# EAGLE schematic PR5009 (EAGLE 6.4)
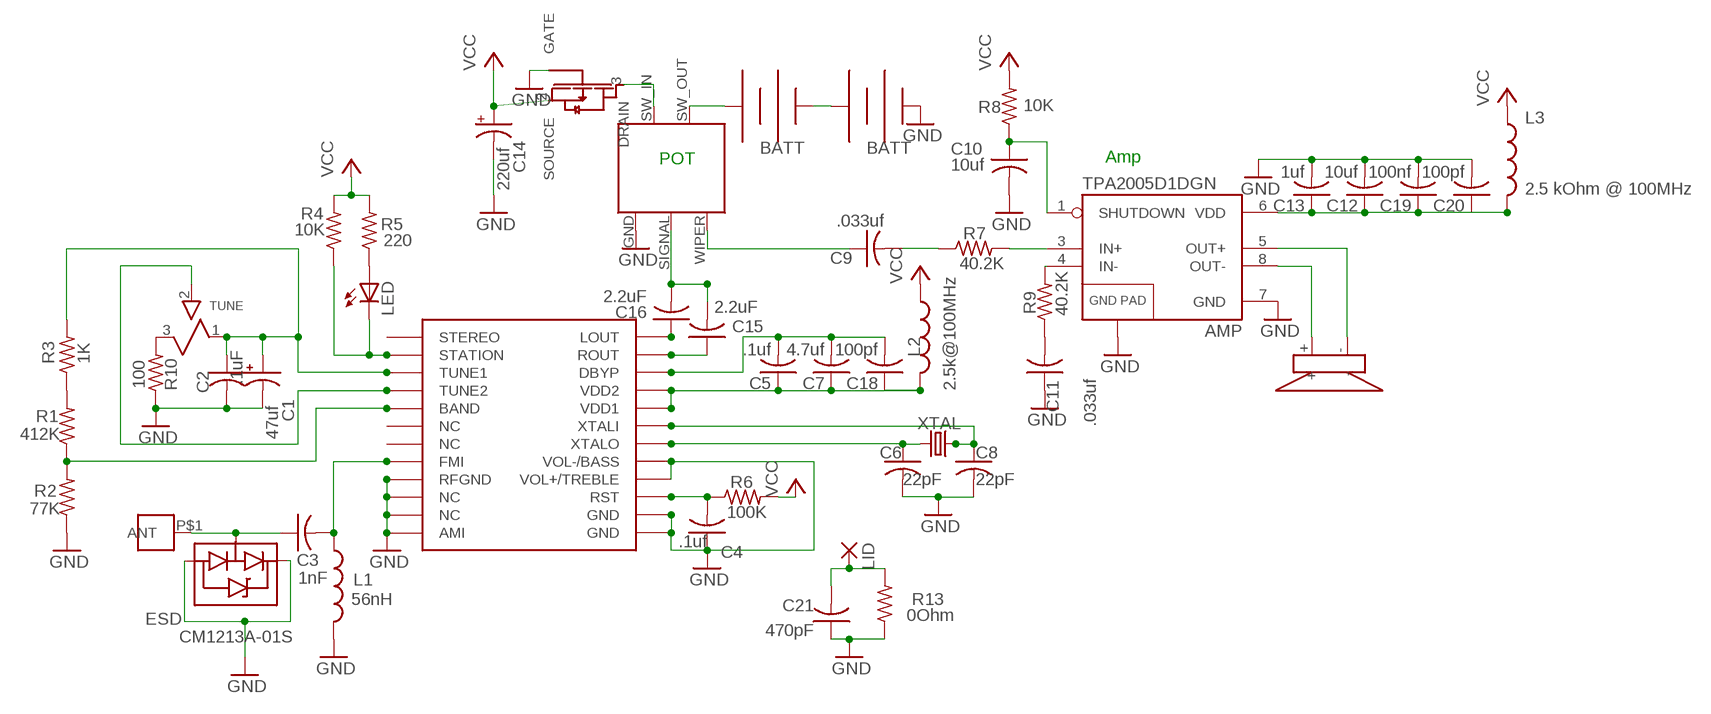
[diagram p0: schematic, sheet 1]

## Parts
AMP  TPA2005D1DGN  [POWER-SOP8]
ANT  M3_SCREW_POST  [M3_SCREW_POST]
C1  47uf  CPOL-USE2-5  [E2-5]
C2  .1uF  C-USC0603  [C0603]
C3  1nF  C-USC0603  [C0603]
C4  .1uf  C-USC0603  [C0603]
C5  .1uf  C-USC0603  [C0603]
C6  22pF  C-USC0603  [C0603]
C7  4.7uf  C-USC0603  [C0603]
C8  22pF  C-USC0603  [C0603]
C9  .033uf  C-USC0603  [C0603]
C10  10uf  C-USC0603  [C0603]
C11  .033uf  C-USC0603  [C0603]
C12  10uf  C-USC0603  [C0603]
C13  1uf  C-USC0603  [C0603]
C14  220uf  CPOL-USE2-5  [E2-5]
C15  2.2uF  C-USC0603  [C0603]
C16  2.2uF  C-USC0603  [C0603]
C18  100pf  C-USC0603  [C0603]
C19  100nf  C-USC0603  [C0603]
C20  100pf  C-USC0603  [C0603]
C21  470pF  C-USC0603  [C0603]
ESD  CM1213A-01S  [SOT23-3]
FET  SI2333DDS  [SI2333DDS]
L1  56nH  INDUCTOR0603  [0603]
L2  2.5k@100MHz  INDUCTOR0603  [0603]
L3  2.5 kOhm @ 100MHz  INDUCTOR0603  [0603]
LED  LEDCHIPLED_0805  [CHIPLED_0805]
LID  2,54/1,0  [2,54/1,0]
R1  412K  R-US_R0603  [R0603]
R2  77K  R-US_R0603  [R0603]
R3  1K  R-US_R0603  [R0603]
R4  10K  R-US_R0603  [R0603]
R5  220  R-US_R0603  [R0603]
R6  100K  R-US_R0603  [R0603]
R7  40.2K  R-US_R0603  [R0603]
R8  10K  R-US_R0603  [R0603]
R9  40.2K  R-US_R0603  [R0603]
R10  100  R-US_R0603  [R0603]
R13  0Ohm  R-US_R0603  [R0603]
TUNE  10k  64XR_BOURNS_TRIMPOT  [64XR_BOURNS_TRIMPOT]
U$1  BK-92_MPD_AA_BATT_CLIP  [BK-92_MPD_AA_BATT_CLIP]
U$2  BK-92_MPD_AA_BATT_CLIP  [BK-92_MPD_AA_BATT_CLIP]
U$3  CE32A_DAYTON_SPKR  [CE32A_DAYTON_SPKR]
U$4  SI4831_FM_IC  [SI4831_FM_IC]
U$5  RV170SF_TAIWANA_POT_SW  [RV170SF_TAIWANA_POT_SW]
XTAL  CRYSTAL32-SMD  [CRYSTAL-32KHZ-SMD]

## Nets
GND: AMP.7(GND) AMP.9(GND) C1.- C2.2 C4.1 C6.2 C8.2 C10.2 C11.1 C12.2 C13.2 C14.- C19.2 C20.2 C21.1 ESD.2(VP) ESD.3(VN) FET.1(GATE) L1.2 R2.1 R10.1 R13.1 U$2.NEG U$2.NEG@2(NEG) U$4.AMI U$4.GND U$4.GND@2(GND) U$4.NC@3(NC) U$4.NC@4(NC) U$4.RFGND U$4.VOL+/TREBLE U$4.VOL-/BASS U$5.GND
N$1: AMP.3(IN+) R7.2
N$2: AMP.4(IN-) R9.2
N$3: C11.2 R9.1
N$4: C9.2 R7.1
N$5: C15.2 C16.2 U$5.SIGNAL
N$6: C5.2 C7.2 C18.2 U$4.DBYP
N$7: C8.1 U$4.XTALI XTAL.X1
N$8: C4.2 R6.1 U$4.RST
N$9: LED.C R4.1 U$4.STATION
N$10: C6.1 U$4.XTALO XTAL.X2
N$11: LED.A R5.1
N$12: TUNE.2 U$4.TUNE2
N$13: R1.1 R2.2 U$4.BAND
N$14: U$1.NEG U$1.NEG@2(NEG) U$2.POS U$2.POS@2(POS)
N$15: C3.2 L1.1 U$4.FMI
N$16: C5.1 C7.1 C18.1 L2.2 U$4.VDD1 U$4.VDD2
N$17: AMP.6(VDD) C12.1 C13.1 C19.1 C20.1 L3.2
N$18: AMP.1(SHUTDOWN) C10.1 R8.1
N$19: ANT.P$1(ANT) C3.1 ESD.1(CH)
N$20: R1.2 R3.1
N$21: U$1.POS U$1.POS@2(POS) U$5.SW_OUT
N$22: C1.+ C2.1 R3.2 TUNE.1 U$4.TUNE1
N$23: AMP.5(OUT+) U$3.-
N$24: AMP.8(OUT-) U$3.+
N$25: C9.1 U$5.WIPER
N$29: R10.2 TUNE.3
N$30: FET.3(DRAIN) U$5.SW_IN
N$31: C15.1 U$4.ROUT
N$32: C21.2 LID.1(P) R13.2
N$33: C16.1 U$4.LOUT
VCC: C14.+ FET.2(SOURCE) L2.1 L3.1 R4.2 R5.2 R6.2 R8.2
Unconnected: U$4.NC U$4.NC@2(NC) U$4.STEREO

## Notes on the sheet
- POT | Amp

## Library data of the parts
AMP = SparkFun-AnalogIC:TPA2005D1: 1.4W MONO CLASS-D AUDIO POWER AMPLIFIER The TPA2005D1 is a 1.4-W high efficiency filter-free class-D audio power amplifier in a BGA, QFN, or MSOP package that requires only three external components. Datasheet: http://focus.ti.com/lit/ds/symlink/tpa2005d1.pdf 1.4 W Into 8 ? From a 5V Supply at THD = 10% (Typ) Maximum Battery Life and Minimum Heat Efficiency With an 8-? Speaker: 84% at 400 mW, 79% at 100 mW 2.8-mA Quiescent Current 0.5-mA Shutdown Current Ideal for Wireless or Cellular Handsets and PDAs Capable of Driving an 8-? Speaker (2.5 V ? VDD ? 5.5 V) and a 4-? Speaker (2.5 V ? VDD ? 4.2 V) Only Three External Components Optimized PWM Output Stage Eliminates LC Output Filter Internally Generated 250-kHz Switching Frequency Eliminates Capacitor and Resistor Improved PSRR (-71 dB at 217 Hz) and Wide Supply Voltage (2.5 V to 5.5 V) Eliminates Need for a Voltage Regulator Fully Differential Design Reduces RF Rectification and Eliminates Bypass Capacitor Improved CMRR Eliminates Two Input Coupling Capacitors
ANT = PR_Libraries:M3_SCREW_POST
C1 C14 = CPOL-US-LongPads :CPOL-US: POLARIZED CAPACITOR, American symbol
C2-C13 C15 C16 C18-C21 = resistor:C-US: CAPACITOR, American symbol
ESD = PubRadioLib:CM1213A-01S: ESD protection
FET = PubRadioLib:SI2333DDS
L1-L3 = SparkFun-Passives:INDUCTOR: Inductors Basic Inductor/Choke - 0603 and 1206. Footprints are not proven and vary greatly between part numbers. SRN6045- 33uH, 20% 1.4A SDR0403-560KL - 56uH, 10%, 500mA RMS/740mA peak
LED = led:LED: LED OSRAM: - CHIPLED LG R971, LG N971, LY N971, LG Q971, LY Q971, LO R971, LY R971 LH N974, LH R974 LS Q976, LO Q976, LY Q976 LO Q996 - Hyper CHIPLED LW Q18S LB Q993, LB Q99A, LB R99A - SideLED LS A670, LO A670, LY A670, LG A670, LP A670 LB A673, LV A673, LT A673, LW A673 LH A674 LY A675 LS A676, LA A676, LO A676, LY A676, LW A676 LS A679, LY A679, LG A679 - Hyper Micro SIDELED® LS Y876, LA Y876, LO Y876, LY Y876 LT Y87S - SmartLED LW L88C, LW L88S LB L89C, LB L89S, LG L890 LS L89K, LO L89K, LY L89K LS L896, LA L896, LO L896, LY L896 - TOPLED LS T670, LO T670, LY T670, LG T670, LP T670 LSG T670, LSP T670, LSY T670, LOP T670, LYG T670 LG T671, LOG T671, LSG T671 LB T673, LV T673, LT T673, LW T673 LH T674 LS T676, LA T676, LO T676, LY T676, LB T676, LH T676, LSB T676, LW T676 LB T67C, LV T67C, LT T67C, LS T67K, LO T67K, LY T67K, LW E67C LS E67B, LA E67B, LO E67B, LY E67B, LB E67C, LV E67C, LT E67C LW T67C LS T679, LY T679, LG T679 LS T770, LO T770, LY T770, LG T770, LP T770 LB T773, LV T773, LT T773, LW T773 LH T774 LS E675, LA E675, LY E675, LS T675 LS T776, LA T776, LO T776, LY T776, LB T776 LHGB T686 LT T68C, LB T68C - Hyper Mini TOPLED® LB M676 - Mini TOPLED Santana® LG M470 LS M47K, LO M47K, LY M47K Source: http://www.osram.convergy.de LUXEON: - LUMILED® LXK2-PW12-R00, LXK2-PW12-S00, LXK2-PW14-U00, LXK2-PW14-V00 LXK2-PM12-R00, LXK2-PM12-S00, LXK2-PM14-U00 LXK2-PE12-Q00, LXK2-PE12-R00, LXK2-PE12-S00, LXK2-PE14-T00, LXK2-PE14-U00 LXK2-PB12-K00, LXK2-PB12-L00, LXK2-PB12-M00, LXK2-PB14-N00, LXK2-PB14-P00, LXK2-PB14-Q00 LXK2-PR12-L00, LXK2-PR12-M00, LXK2-PR14-Q00, LXK2-PR14-R00 LXK2-PD12-Q00, LXK2-PD12-R00, LXK2-PD12-S00 LXK2-PH12-R00, LXK2-PH12-S00 LXK2-PL12-P00, LXK2-PL12-Q00, LXK2-PL12-R00 Source: www.luxeon.com KINGBRIGHT: KA-3528ASYC Source: www.kingbright.com
LID = wirepad:2,54/1,0: THROUGH-HOLE PAD
R1-R10 R13 = resistor:R-US_: RESISTOR, American symbol
TUNE = PR_Libraries:64XR_BOURNS_TRIMPOT: This is a bourns trimpot
U$1 U$2 = PR_Libraries:BK-92_MPD_AA_BATT_CLIP
U$3 = PR_Libraries:CE32A_DAYTON_SPKR
U$4 = PR_Libraries:SI4831_FM_IC
U$5 = PR_Libraries:RV170SF_TAIWANA_POT_SW
XTAL = SparkFun-FreqCtrl:CRYSTAL: Various standard crystals. Proven footprints. Spark Fun Electronics SKU : COM-00534; PROD_ID: XTAL-07894